# EAGLE schematic Moteino_Leo-OLM (EAGLE 6.5.0)
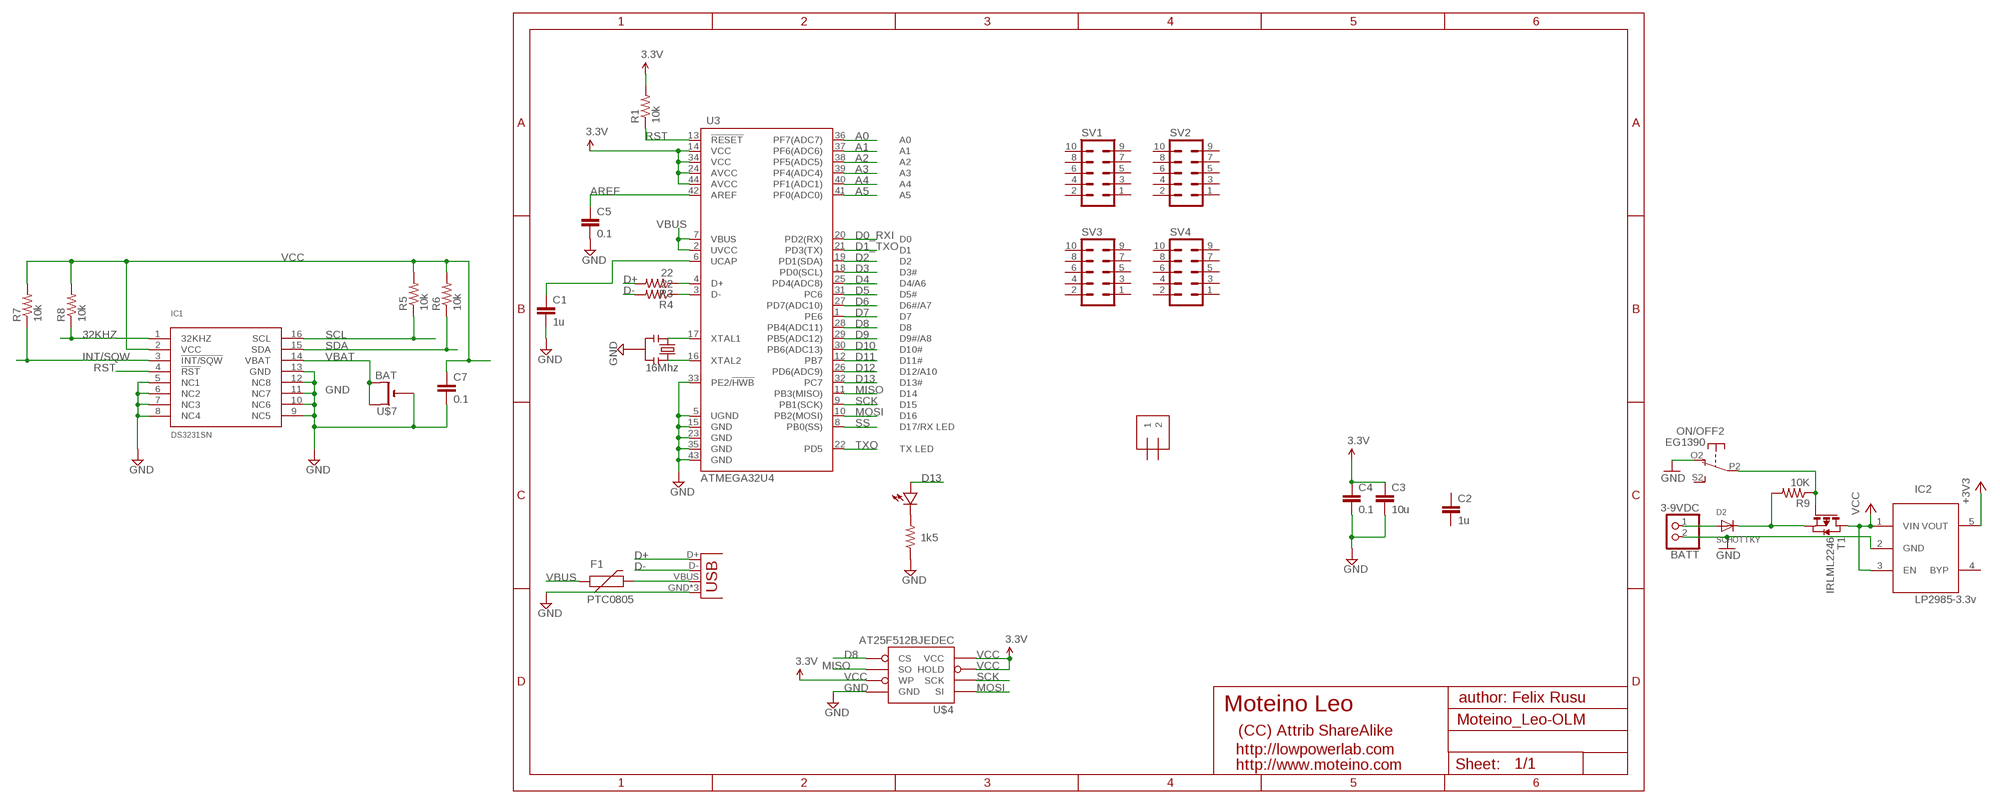
[diagram p0: schematic, sheet 1]

## Parts
BATT  3-9VDC  JST_2PIN-SMT-RA  [JST-PH-2-SMT-RA]
C1  1u  CAP0603-CAP  [0603-CAP]
C2  1u  CAP0603-CAP  [0603-CAP]
C3  10u  CAP0805-CAP  [0805-CAP]
C4  0.1  CAP0603-CAP  [0603-CAP]
C5  0.1  CAP0603-CAP  [0603-CAP]
C7  0.1  CAP0603-CAP  [0603-CAP]
D2  SCHOTTKY  DIODESOD-123  [SOD-123]
F1  PTC0805  [0805-PTC]
IC1  DS3231SN  [SO16W]
IC2  LP2985-3.3v  LP298XS  [SOT23-5L]
J1  1X2-3.5MM  [1X2-3.5MM]
JP3  USB-MICROB  [USB-MICROB]
ON/OFF  EG1390  DPDT-EG1390  [EG1390]
R1  10k  RESISTOR0603-RES  [0603-RES]
R2  1k5  RESISTOR0603-RES  [0603-RES]
R3  22  RESISTOR0603-RES  [0603-RES]
R4  22  RESISTOR0603-RES  [0603-RES]
R5  10k  RESISTOR0603-RES  [0603-RES]
R6  10k  RESISTOR0603-RES  [0603-RES]
R7  10k  RESISTOR0603-RES  [0603-RES]
R8  10k  RESISTOR0603-RES  [0603-RES]
R9  10K  R-US_R0805  [R0805]
SV1  MA05-2  [MA05-2]
SV2  MA05-2  [MA05-2]
SV3  MA05-2  [MA05-2]
SV4  MA05-2  [MA05-2]
T1  IRLML2246  PMOSSOT23  [SOT-23]
U3  ATMEGA32U4  ATMEGA32U4QFN2  [QFN-44-NOPAD]
U$2  LED0603  [0603-LED]
U$4  AT25F512BJEDEC  [SO08]
U$7  BAT  CR1220SMT  [CR1220-SMD]
X1  16Mhz  RESONATORSMD  [RESONATOR-SMD]

## Nets
32KHZ: IC1.1(32KHZ) R8.1
+3V3: IC2.5(VOUT)
A0: U3.36(PF7(ADC7))
A1: U3.37(PF6(ADC6))
A2: U3.38(PF5(ADC5))
A3: U3.39(PF4(ADC4))
A4: U3.40(PF1(ADC1))
A5: U3.41(PF0(ADC0))
AREF: C5.1 U3.42(AREF)
D0_RXI: U3.20(PD2(RX))
D1_TXO: U3.21(PD3(TX))
D2: U3.19(PD1(SDA))
D3: U3.18(PD0(SCL))
D4: U3.25(PD4(ADC8))
D5: U3.31(PC6)
D6: U3.27(PD7(ADC10))
D7: U3.1(PE6)
D8: U3.28(PB4(ADC11)) U$4.1_CS(CS)
D9: U3.29(PB5(ADC12))
D10: U3.30(PB6(ADC13))
D11: U3.12(PB7)
D12: U3.26(PD6(ADC9))
D13: U3.32(PC7) U$2.PLUS
D+: JP3.D+ R3.2
D-: JP3.D- R4.2
GND [power]: BATT.2 C1.2 C3.2 C4.2 C5.2 C7.2 IC1.5(NC1) IC1.6(NC2) IC1.7(NC3) IC1.8(NC4) IC1.9(NC5) IC1.10(NC6) IC1.11(NC7) IC1.12(NC8) IC1.13(GND) IC2.2(GND) JP3.GND JP3.MT1(GND) JP3.MT2(GND) ON/OFF.O2(2:O) R2.1 U3.5(UGND) U3.15(GND) U3.23(GND) U3.33(PE2/!HWB) U3.35(GND) U3.43(GND) U$4.4_GND(GND) U$7.- X1.2
INT/SQW: IC1.3(!INT/SQW) R7.1
MISO: U3.11(PB3(MISO)) U$4.2_SO(SO)
MOSI: U3.10(PB2(MOSI)) U$4.5_SI(SI)
N$1: R2.2 U$2.MINUS
N$2: BATT.1 D2.A
N$3: D2.C R9.2 T1.2(S)
N$4: U3.16(XTAL2) X1.3
N$5: U3.17(XTAL1) X1.1
N$6: C1.1 U3.6(UCAP)
N$7: R3.1 U3.4(D+)
N$8: R4.1 U3.3(D-)
N$13: ON/OFF.P2(2:P) R9.1 T1.3(G)
RST: IC1.4(!RST) R1.1 U3.13(!RESET)
SCK: U3.9(PB1(SCK)) U$4.6_SCK(SCK)
SCL: IC1.16(SCL) R5.1
SDA: IC1.15(SDA) R6.1
SS: U3.8(PB0(SS))
TXO: U3.22(PD5)
USBPOWER [power]: F1.2 JP3.VBUS
VBAT: IC1.14(VBAT) U$7.+$1(+) U$7.+$2(+1)
VBUS [power]: F1.1 U3.2(UVCC) U3.7(VBUS)
VCC [power]: C3.1 C4.1 C7.1 IC1.2(VCC) IC2.1(VIN) IC2.3(EN) R1.2 R5.2 R6.2 R7.2 R8.2 T1.1(D) U3.14(VCC) U3.24(AVCC) U3.34(VCC) U3.44(AVCC) U$4.3_WP(WP) U$4.7_HOLD(HOLD) U$4.8_VCC(VCC) ; supply symbol labelled 3.3V
Unconnected: C2.1 C2.2 IC2.4(BYP) J1.1 J1.2 ON/OFF.O1(1:O) ON/OFF.P1(1:P) ON/OFF.S1(1:S) ON/OFF.S2(2:S) SV1.1 SV1.2 SV1.3 SV1.4 SV1.5 SV1.6 SV1.7 SV1.8 SV1.9 SV1.10 SV2.1 SV2.2 SV2.3 SV2.4 SV2.5 SV2.6 SV2.7 SV2.8 SV2.9 SV2.10 SV3.1 SV3.2 SV3.3 SV3.4 SV3.5 SV3.6 SV3.7 SV3.8 SV3.9 SV3.10 SV4.1 SV4.2 SV4.3 SV4.4 SV4.5 SV4.6 SV4.7 SV4.8 SV4.9 SV4.10

## Notes on the sheet
- author: Felix Rusu
- Moteino Leo
- (CC) Attrib ShareAlike
- http://lowpowerlab.com
- http://www.moteino.com

## Library data of the parts
BATT = adafruit:JST_2PIN: JST 2-Pin Connectors of various flavors SMT-RA (S2B-PH-SM4) 4UConnector #17311 SMT (B2B-PH-SM4) THM-RA (S2B-PH) THM (B2B-PH)
C1-C5 C7 = LowPowerLab:CAP: Capacitor Standard 0603 ceramic capacitor, and 0.1" leaded capacitor.
D2 = adafruit:DIODE: Diode SMADIODE - SMA Surface Mount Package 20V 1A Schottky Diode Digikey: 641-1014-6-ND DO-1N4148 - Through Hole Small Current Diode SOD-123 20V 1 A (.5mV Vf) Schottky Diode - Digikey: MBRX120TPMSCT-ND SOD-323 10V 570mA (.38mV Vf, 3ns) Schottky Diode - Digikey: ZLLS410CT-ND SOD-523 30V 30mA Schottky Diode (RB751S-40TE61) - Digikey: RB751S-40TE61CT-ND SOT23-R/W - SOT23 Package (R = Solder Paste/Reflow Ovens, W = Hand-Soldering) BAT54Film 40V 300mA - Digikey: 497-7162-1-ND
F1 = LowPowerLab:PTC: Resettable Fuse PTC Resettable Fuse. Spark Fun Electronics SKU : COM-08357
IC1 = comfile:DS3231SN
IC2 = adafruit:LP298X
J1 = adafruit:1X2: 3.5mm Terminal block http://www.ladyada.net/library/pcb/eaglelibrary.html
JP3 = SparkFun-Connectors:USB: USB Connectors USB-B-PTH is fully proven SKU : PRT-00139/CONN-08278 USB-miniB is fully proven SKU : PRT-00587 USB-A-PCB is untested. USB-A-H is throughly reviewed, but untested. Spark Fun Electronics SKU : PRT-00437 USB-B-SMT is throughly reviewed, but untested. Needs silkscreen touching up. USB-A-S has not been used/tested USB-MB-H has not been used/tested USB-MICROB has been used. CONN-09505; PROD_ID: CONN-09505
ON/OFF = adafruit:DPDT
R1-R8 = LowPowerLab:RESISTOR: Resistor Basic schematic elements and footprints for 0603, 1206, and PTH resistors.
R9 = adafruit:R-US_: RESISTOR, American symbol
SV1-SV4 = con-lstb:MA05-2: PIN HEADER; OC_FARNELL: unknown; OC_NEWARK: unknown
T1 = zetex:PMOSSOT23: MOS FET
U3 = SparkFun:ATMEGA32U4
U$2 = LowPowerLab:LED
U$4 = LowPowerLab:AT25F512B: 4-Mbit SPI flash memory
U$7 = adafruit:CR1220: CR1216/CR1220/CR1225 12mm 3V lithium coin cell Great for battery packup. Both SMT and THM holders. Note the THM package has the ground pads on both sides of the PCB so that the masks are the same - this reduces the cost
X1 = SparkFun:RESONATOR: Resonator Small SMD resonator. This is the itty bitty 10/20MHz resonators with built in caps. CSTCE10M0G55 and CSTCE20M0V53. Footprint has been reviewed closely but hasn't been tested yet.

## Net classes
1 power: width 0.203 mm, clearance 0.152 mm